# EAGLE design irisc (EAGLE 9.2.2)
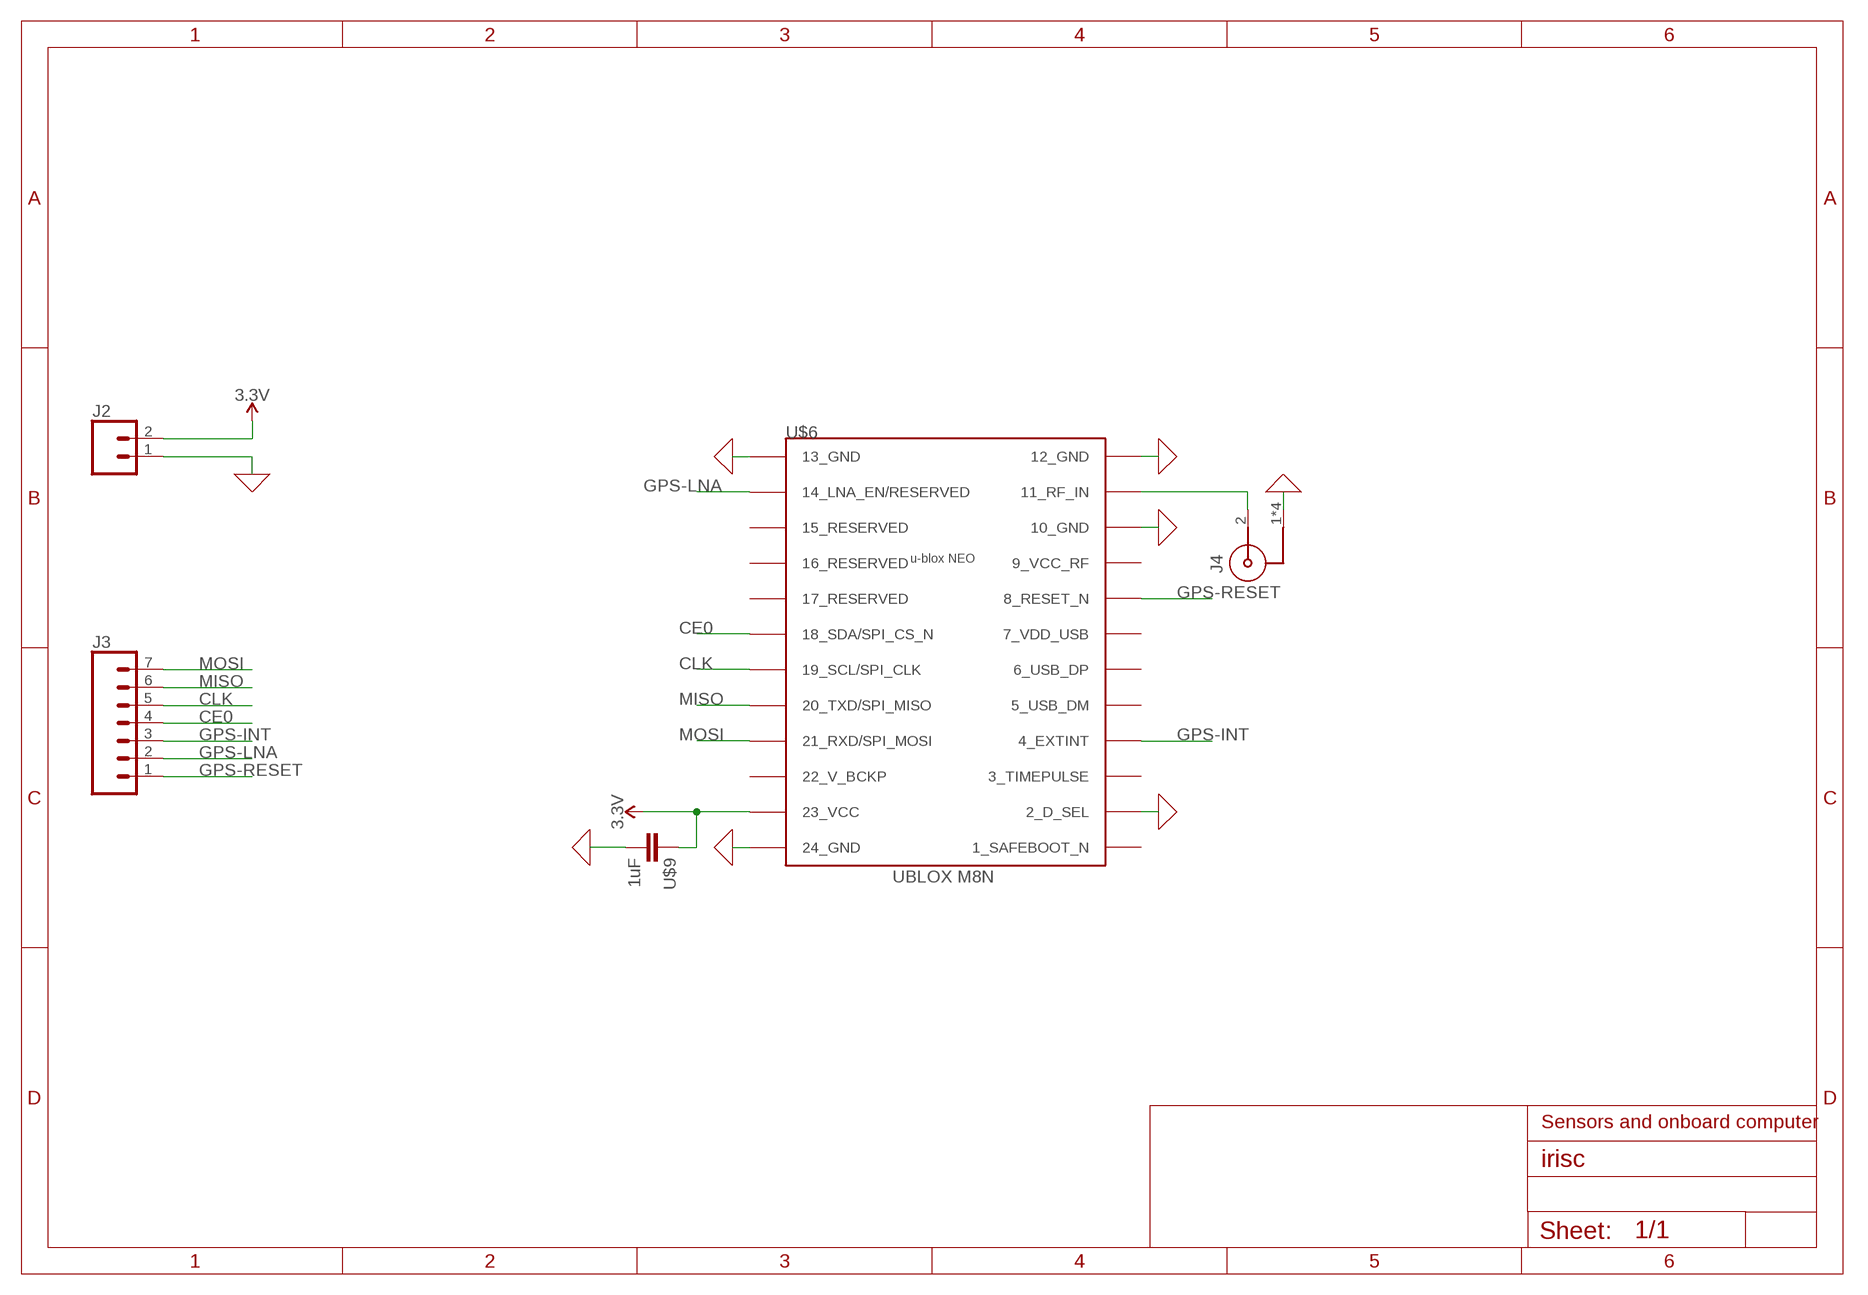
[diagram p0: schematic, sheet 1]

## Parts
J2  CONN_02  [1X02]
J3  CONN_07  [1X07]
J4  60312202114508  [60312202114508]
U$6  NEO-M8  [NEO-M8]
U$9  1uF  CAPACITOR_0603_N  [RESC0603_N]

## Nets
0: J2.1 J4.1 J4.3 J4.4 J4.5 U$6.2(2_D_SEL) U$6.10(10_GND) U$6.12(12_GND) U$6.13(13_GND) U$6.24(24_GND) U$9.2 ; supply symbol labelled GND
3.3V: J2.2 U$6.23(23_VCC) U$9.1
CE0: J3.4 U$6.18(18_SDA/SPI_CS_N)
CLK: J3.5 U$6.19(19_SCL/SPI_CLK)
GPS-INT: J3.3 U$6.4(4_EXTINT)
GPS-LNA: J3.2 U$6.14(14_LNA_EN/RESERVED)
GPS-RESET: J3.1 U$6.8(8_RESET_N)
MISO: J3.6 U$6.20(20_TXD/SPI_MISO)
MOSI: J3.7 U$6.21(21_RXD/SPI_MOSI)
N$39: J4.2 U$6.11(11_RF_IN)
Unconnected: U$6.1(1_SAFEBOOT_N) U$6.3(3_TIMEPULSE) U$6.5(5_USB_DM) U$6.6(6_USB_DP) U$6.7(7_VDD_USB) U$6.9(9_VCC_RF) U$6.15(15_RESERVED) U$6.16(16_RESERVED) U$6.17(17_RESERVED) U$6.22(22_V_BCKP)

## Notes on the sheet
- Sensors and onboard computer

## Library data of the parts
J2 = SparkFun-Connectors:CONN_02: Multi connection point. Often used as Generic Header-pin footprint for 0.1 inch spaced/style header connections On any of the 0.1 inch spaced packages, you can populate with these: Break Away Headers - Straight <https://www.sparkfun.com/products/116> (PRT-00116) Break Away Male Headers - Right Angle <https://www.sparkfun.com/products/553> (PRT-00553) Female Headers <https://www.sparkfun.com/products/115> (PRT-00115) Break Away Headers - Machine Pin <https://www.sparkfun.com/products/117> (PRT-00117) Break Away Female Headers - Swiss Machine Pin <https://www.sparkfun.com/products/743> (PRT-00743) For SCREWTERMINALS and SPRING TERMINALS visit here: Screw Terimnals on SparkFun.com <https://www.sparkfun.com/search/results?term=Screw+Terminals> (5mm/3.5mm/2.54mm spacing) This device is also useful as a general connection point to wire up your design to another part of your project. Our various solder wires solder well into these plated through hole pads. Hook-Up Wire - Assortment (Stranded, 22 AWG) <https://www.sparkfun.com/products/11375> (PRT-11375) Hook-Up Wire - Assortment (Solid Core, 22 AWG) <https://www.sparkfun.com/products/11367> (PRT-11367) View the entire wire category on our website here <https://www.sparkfun.com/categories/141> Special notes: Molex polarized connector foot print use with: PRT-08233 with associated crimp pins and housings. 2.54_SCREWTERM for use with PRT-10571. 3.5mm Screw Terminal footprints for PRT-08084 5mm Screw Terminal footprints for use with PRT-08432
J3 = SparkFun-Connectors:CONN_07: Multi connection point. Often used as Generic Header-pin footprint for 0.1 inch spaced/style header connections On any of the 0.1 inch spaced packages, you can populate with these: Break Away Headers - Straight <https://www.sparkfun.com/products/116> (PRT-00116) Break Away Male Headers - Right Angle <https://www.sparkfun.com/products/553> (PRT-00553) Female Headers <https://www.sparkfun.com/products/115> (PRT-00115) Break Away Headers - Machine Pin <https://www.sparkfun.com/products/117> (PRT-00117) Break Away Female Headers - Swiss Machine Pin <https://www.sparkfun.com/products/743> (PRT-00743) For SCREWTERMINALS and SPRING TERMINALS visit here: Screw Terimnals on SparkFun.com <https://www.sparkfun.com/search/results?term=Screw+Terminals> (5mm/3.5mm/2.54mm spacing) This device is also useful as a general connection point to wire up your design to another part of your project. Our various solder wires solder well into these plated through hole pads. Hook-Up Wire - Assortment (Stranded, 22 AWG) <https://www.sparkfun.com/products/11375> (PRT-11375) Hook-Up Wire - Assortment (Solid Core, 22 AWG) <https://www.sparkfun.com/products/11367> (PRT-11367) View the entire wire category on our website here <https://www.sparkfun.com/categories/141> Special notes: Molex polarized connector foot print use with SKU : PRT-08231 with associated crimp pins and housings. 1MM SMD Version SKU: PRT-10208 NOTES ON THE VARIANTS LOCK and LOCK_LONGPADS... This footprint was designed to help hold the alignment of a through-hole component (i.e. 6-pin header) while soldering it into place. You may notice that each hole has been shifted either up or down by 0.005 of an inch from it's more standard position (which is a perfectly straight line). This slight alteration caused the pins (the squares in the middle) to touch the edges of the holes. Because they are alternating, it causes a "brace" to hold the component in place. 0.005 has proven to be the perfect amount of "off-center" position when using our standard breakaway headers. Although looks a little odd when you look at the bare footprint, once you have a header in there, the alteration is very hard to notice. Also,if you push a header all the way into place, it is covered up entirely on the bottom side.
J4 = Wurth_Elektronik_Electromechanic_Coaxial _Connectors_rev18a:60312202114508: SMA PCB End Launch Jack Round Post for 1.1mm PCB WR-SMA ARTICLE PROPERTIES: PCB Thickness 1.1 mm MATERIAL PROPERTIES: Insulator Material PTFE Insulator Color White Center Contact Material Beryllium Copper Center Contact Plating Gold, min. 0.76µm over Nickel Body Material Brass Body Plating Gold, min. 0.076µm over Nickel KIND PROPERTIES: Interface MIL-STD-348 Connector Type SMA Gender Jack Orientation Type Straight GENERAL INFORMATION: Operating Temperature -65 °C up to +165 °C Compliance RoHS ELECTRICAL PROPERTIES: Impedance 50 Ω Frequency Range DC~18 GHz MECHANICAL PROPERTIES: Center Contact Retention (Axial) 26.7 N Mating Cycle 500 Cycles Recommended Mating Torque 57 Ncm PACKAGING PROPERTIES: Packaging Tray <http://katalog.we-online.de/media/images/v2/WR-SMA_60312202114508.jpg> Details see: http://katalog.we-online.de/em/datasheet/60312202114508.pdf Created 2018-04-24,Yingchun,Shan 2018(C) Würth Elektronik
U$6 = ubloxLib:NEO-M8: u-blox NEO GNSS module
U$9 = Nordic_nRF:CAPACITOR: Generic chip capacitor

## Board
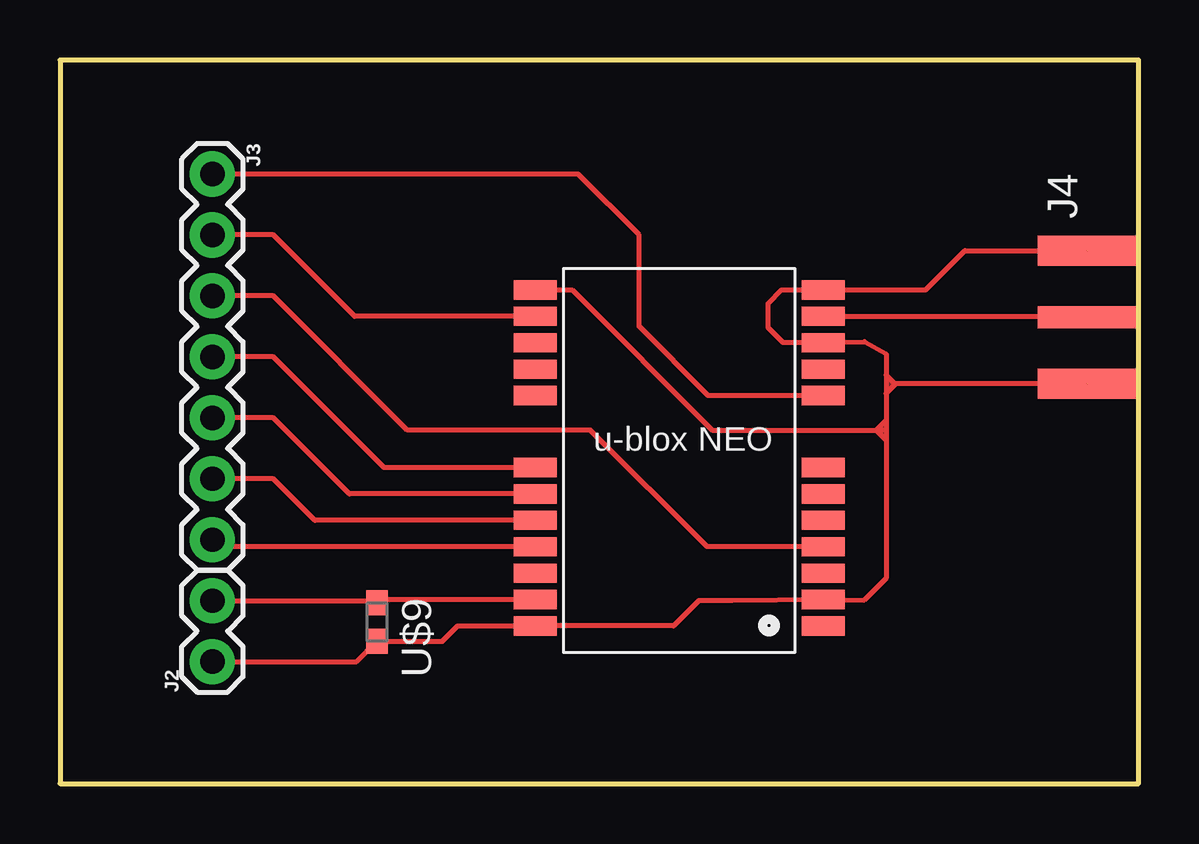
[diagram p1: board, top side]
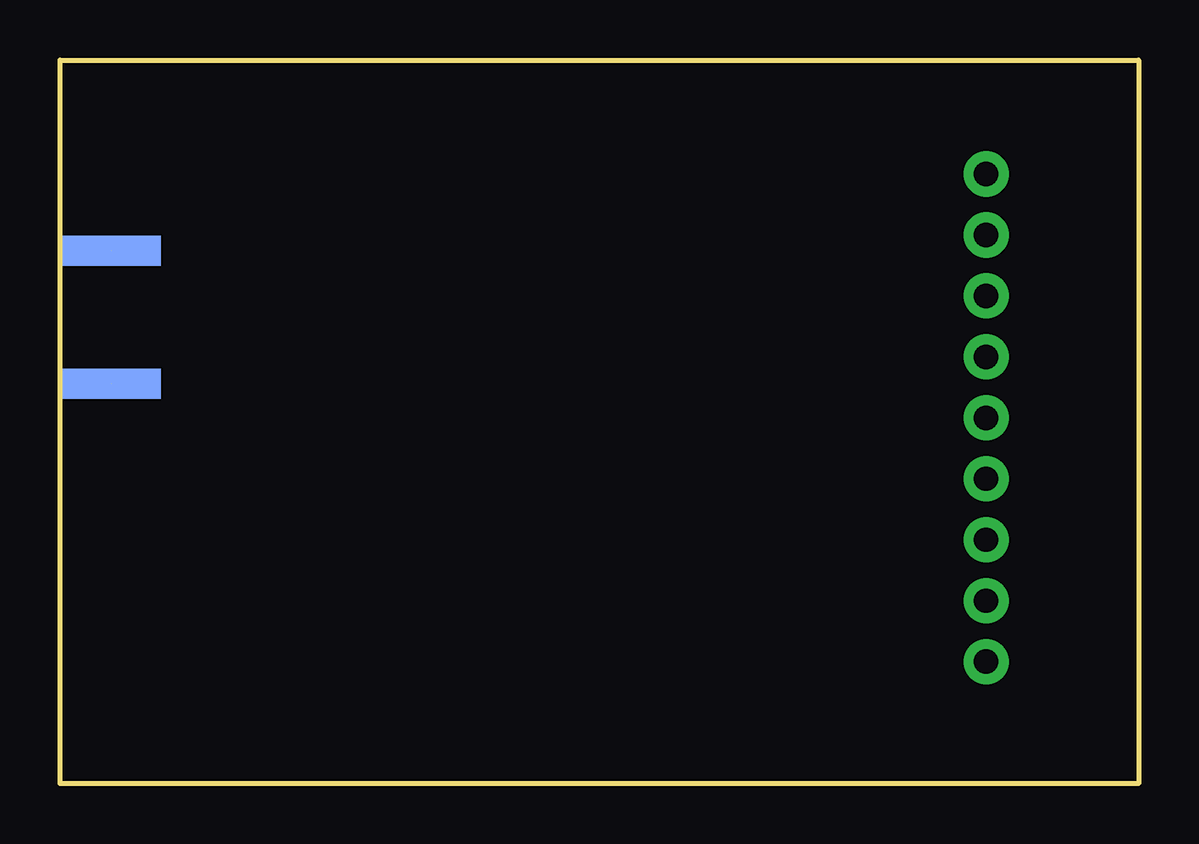
[diagram p2: board, bottom side, seen from below]

Size 44.94 x 30.15 mm. Coordinates in mm from the lower left corner, seen from the top.
Outline: 0,0 44.94,0 44.94,30.15 0,30.15 0,0
Copper layers (1*16): Top 0.035mm / dielectric 1.5mm / Bottom 0.035mm
Design rules "default": minimum track width 6mil, minimum drill 0.35mm, track to track 6mil, track to pad 6mil, pad to pad 6mil, via to via 6mil, smd to smd 6mil, copper to edge 40mil, drill to drill 6mil, minimum pad ring 10mil, minimum via ring 8mil, stop-mask expansion 4mil, vias tented up to drill 0mil, thermal gap 10mil

### Footprints (pad centres in the part's own frame; a part is rotated, then mirrored left to right if it is on the bottom)
1X02 = drill 1.016 pad 1.88: 1 0,0; 2 2.54,0
1X07 = drill 1.016 pad 1.88: 1 0,0; 2 2.54,0; 3 5.08,0; 4 7.62,0; 5 10.16,0; 6 12.7,0; 7 15.24,0
60312202114508 = smd 1.25 x 4.1: 1 -2.775,0; 3 2.775,0 | smd 0.9 x 4.1: 2 0,0 | smd 1.25 x 4.1 bottom: 4 -2.775,0; 5 2.775,0
NEO-M8 = smd 1.8 x 0.8: 1 6.4,-7.4; 2 6.4,-6.3; 3 6.4,-5.2; 4 6.4,-4.1; 5 6.4,-3; 6 6.4,-1.9; 7 6.4,-0.8; 8 6.4,2.2; 9 6.4,3.3; 10 6.4,4.4; 11 6.4,5.5; 12 6.4,6.6; 13 -5.6,6.6; 14 -5.6,5.5; 15 -5.6,4.4; 16 -5.6,3.3; 17 -5.6,2.2; 18 -5.6,-0.8; 19 -5.6,-1.9; 20 -5.6,-3; 21 -5.6,-4.1; 22 -5.6,-5.2; 23 -5.6,-6.3; 24 -5.6,-7.4
RESC0603_N = smd 1.05 x 0.9: 1 -0.8,0; 2 0.8,0

### Placement (x,y rotation side)
J2  6.35,5.08 90 top
J3  6.35,25.4 270 top
J4  42.8,19.43 90 top
U$6  25.4,13.97 0 top
U$9  13.21,6.73 270 top

### Tracks (layer width: path | path; a pad name or v marks a point on that pad's centre or on a via)
0  (2 unrouted)
  Top 0.2: U$6.13 21.34,20.57 27.18,14.73 34,14.73 | 34,14.73 34.29,14.73 | 28,7.62 U$6.2 33.5,7.65 34.42,8.56 34.42,14.31 | 28,7.62 27.94,7.62 | J2.1 12.36,5.08 U$9.2 15.93,5.93 16.57,6.57 U$6.24 25.57,6.57 26.62,7.62 28,7.62 | 34.42,17.02 34.42,17.91 33.53,18.41 U$6.10 30.13,18.37 29.5,19 29.5,20 30.07,20.57 U$6.12 36.07,20.57 37.71,22.21 J4.5 | 34.42,17.02 34.42,16.26 | 34.42,16.26 34.42,15.15 | 34.42,15.15 34.42,14.31 | 34,14.73 34.42,15.15 | 34,14.73 34.42,14.31 | J4.4 34.82,16.66 | 34.82,16.66 34.42,16.26 | 34.82,16.66 34.78,16.66 34.42,17.02
  pour Top: 34.04,14.73 34.42,15.11 34.42,14.35
  pour Top: 34.42,17.02 34.8,16.64 34.42,16.26
3.3V
  Top 0.2: J2.2 13.12,7.62 U$9.1 13.35,7.67 U$6.23
CE0
  Top 0.2: U$6.18 13.5,13.17 8.89,17.78 J3.4
CLK
  Top 0.2: U$6.19 12.06,12.07 8.89,15.24 J3.5
GPS-INT
  Top 0.2: U$6.4 26.96,9.87 22.1,14.73 14.48,14.73 8.89,20.32 J3.3
GPS-LNA
  Top 0.2: U$6.14 12.28,19.47 8.89,22.86 J3.2
GPS-RESET
  Top 0.2: U$6.8 27.01,16.17 24.13,19.05 24.13,22.86 21.59,25.4 J3.1
MISO
  Top 0.2: U$6.20 10.62,10.97 8.89,12.7 J3.6
MOSI
  Top 0.2: U$6.21 6.64,9.87 J3.7
N$39
  Top 0.2: U$6.11 42.76,19.47 J4.2